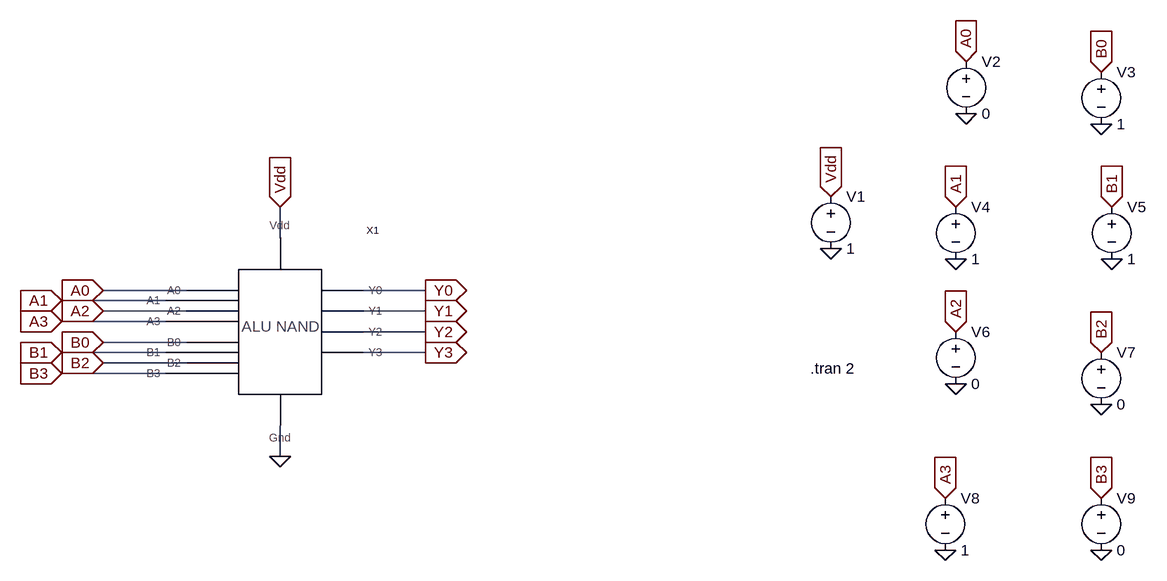
[diagram p0: schematic ALU_NAND_TEST.asc]
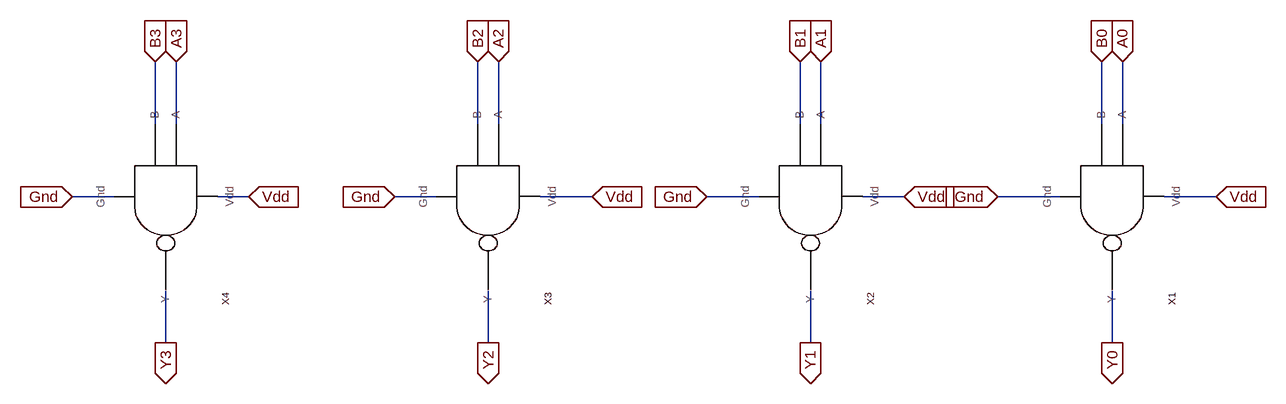
[diagram p1: sub-circuit alu_nand.asc]
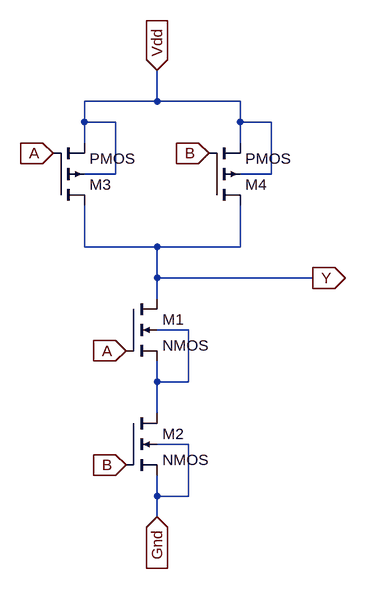
[diagram p2: sub-circuit nand.asc]
ALU_NAND_TEST.asc, the LTspice schematic file:
Version 4
SHEET 1 1656 680
WIRE 272 -144 272 -192
WIRE 128 -64 0 -64
WIRE 496 -64 400 -64
WIRE 96 -48 -64 -48
WIRE 128 -32 0 -32
WIRE 496 -32 400 -32
WIRE 96 -16 -64 -16
WIRE 496 0 400 0
WIRE 128 16 0 16
WIRE 96 32 -64 32
WIRE 496 32 400 32
WIRE 128 48 0 48
WIRE 96 64 -64 64
WIRE 272 192 272 144
FLAG 1120 -208 Vdd
IOPIN 1120 -208 In
FLAG 1328 -416 A0
IOPIN 1328 -416 In
FLAG 1536 -400 B0
IOPIN 1536 -400 In
FLAG 1312 -192 A1
IOPIN 1312 -192 In
FLAG 1552 -192 B1
IOPIN 1552 -192 In
FLAG 1312 0 A2
IOPIN 1312 0 In
FLAG 1536 32 B2
IOPIN 1536 32 In
FLAG 1296 256 A3
IOPIN 1296 256 In
FLAG 1536 256 B3
IOPIN 1536 256 In
FLAG 1120 -128 0
FLAG 1328 -336 0
FLAG 1536 -320 0
FLAG 1312 -112 0
FLAG 1552 -112 0
FLAG 1312 80 0
FLAG 1536 112 0
FLAG 1296 336 0
FLAG 1536 336 0
FLAG 272 192 0
FLAG 272 -192 Vdd
IOPIN 272 -192 In
FLAG 0 -64 A0
IOPIN 0 -64 In
FLAG -64 -48 A1
IOPIN -64 -48 In
FLAG 0 -32 A2
IOPIN 0 -32 In
FLAG -64 -16 A3
IOPIN -64 -16 In
FLAG 0 16 B0
IOPIN 0 16 In
FLAG -64 32 B1
IOPIN -64 32 In
FLAG 0 48 B2
IOPIN 0 48 In
FLAG -64 64 B3
IOPIN -64 64 In
FLAG 496 -64 Y0
IOPIN 496 -64 Out
FLAG 496 -32 Y1
IOPIN 496 -32 Out
FLAG 496 0 Y2
IOPIN 496 0 Out
FLAG 496 32 Y3
IOPIN 496 32 Out
SYMBOL ALU_NAND 288 -32 R0
SYMATTR InstName X1
SYMBOL voltage 1120 -224 R0
WINDOW 123 0 0 Left 0
WINDOW 39 0 0 Left 0
SYMATTR InstName V1
SYMATTR Value 1
SYMBOL voltage 1328 -432 R0
WINDOW 123 0 0 Left 0
WINDOW 39 0 0 Left 0
SYMATTR InstName V2
SYMATTR Value 0
SYMBOL voltage 1536 -416 R0
WINDOW 123 0 0 Left 0
WINDOW 39 0 0 Left 0
SYMATTR InstName V3
SYMATTR Value 1
SYMBOL voltage 1312 -208 R0
WINDOW 123 0 0 Left 0
WINDOW 39 0 0 Left 0
SYMATTR InstName V4
SYMATTR Value 1
SYMBOL voltage 1552 -208 R0
WINDOW 123 0 0 Left 0
WINDOW 39 0 0 Left 0
SYMATTR InstName V5
SYMATTR Value 1
SYMBOL voltage 1312 -16 R0
WINDOW 123 0 0 Left 0
WINDOW 39 0 0 Left 0
SYMATTR InstName V6
SYMATTR Value 0
SYMBOL voltage 1536 16 R0
WINDOW 123 0 0 Left 0
WINDOW 39 0 0 Left 0
SYMATTR InstName V7
SYMATTR Value 0
SYMBOL voltage 1296 240 R0
WINDOW 123 0 0 Left 0
WINDOW 39 0 0 Left 0
SYMATTR InstName V8
SYMATTR Value 1
SYMBOL voltage 1536 240 R0
WINDOW 123 0 0 Left 0
WINDOW 39 0 0 Left 0
SYMATTR InstName V9
SYMATTR Value 0
TEXT 1088 56 Left 2 !.tran 2

alu_nand.asc, the sub-circuit schematic file:
Version 4
SHEET 1 1000 680
WIRE -736 0 -736 -96
WIRE -704 0 -704 -96
WIRE -240 0 -240 -96
WIRE -208 0 -208 -96
WIRE 256 0 256 -96
WIRE 288 0 288 -96
WIRE 720 0 720 -96
WIRE 752 0 752 -96
WIRE -800 112 -864 112
WIRE -592 112 -640 112
WIRE -304 112 -368 112
WIRE -64 112 -144 112
WIRE 192 112 112 112
WIRE 416 112 352 112
WIRE 656 112 560 112
WIRE 896 112 816 112
WIRE -720 336 -720 256
WIRE -224 336 -224 256
WIRE 272 336 272 256
WIRE 736 336 736 256
FLAG 736 336 Y0
IOPIN 736 336 Out
FLAG 272 336 Y1
IOPIN 272 336 Out
FLAG -224 336 Y2
IOPIN -224 336 Out
FLAG -720 336 Y3
IOPIN -720 336 Out
FLAG 752 -96 A0
IOPIN 752 -96 In
FLAG 288 -96 A1
IOPIN 288 -96 In
FLAG -208 -96 A2
IOPIN -208 -96 In
FLAG -704 -96 A3
IOPIN -704 -96 In
FLAG 720 -96 B0
IOPIN 720 -96 In
FLAG 256 -96 B1
IOPIN 256 -96 In
FLAG -240 -96 B2
IOPIN -240 -96 In
FLAG -736 -96 B3
IOPIN -736 -96 In
FLAG -592 112 Vdd
IOPIN -592 112 In
FLAG -64 112 Vdd
IOPIN -64 112 In
FLAG 416 112 Vdd
IOPIN 416 112 In
FLAG 896 112 Vdd
IOPIN 896 112 In
FLAG 560 112 Gnd
IOPIN 560 112 In
FLAG 112 112 Gnd
IOPIN 112 112 In
FLAG -368 112 Gnd
IOPIN -368 112 In
FLAG -864 112 Gnd
IOPIN -864 112 In
SYMBOL nand 752 112 R90
SYMATTR InstName X1
SYMBOL nand 288 112 R90
SYMATTR InstName X2
SYMBOL nand -208 112 R90
SYMATTR InstName X3
SYMBOL nand -704 112 R90
SYMATTR InstName X4

nand.asc, the sub-circuit schematic file:
Version 4
SHEET 1 880 680
WIRE 192 -176 192 -224
WIRE 192 -176 80 -176
WIRE 320 -176 192 -176
WIRE 80 -144 80 -176
WIRE 128 -144 80 -144
WIRE 320 -144 320 -176
WIRE 368 -144 320 -144
WIRE 80 -112 80 -144
WIRE 320 -112 320 -144
WIRE 128 -64 128 -144
WIRE 128 -64 80 -64
WIRE 368 -64 368 -144
WIRE 368 -64 320 -64
WIRE 80 48 80 -16
WIRE 192 48 80 48
WIRE 320 48 320 -16
WIRE 320 48 192 48
WIRE 192 96 192 48
WIRE 432 96 192 96
WIRE 192 128 192 96
WIRE 240 176 192 176
WIRE 192 256 192 224
WIRE 240 256 240 176
WIRE 240 256 192 256
WIRE 192 304 192 256
WIRE 240 352 192 352
WIRE 192 432 192 400
WIRE 240 432 240 352
WIRE 240 432 192 432
WIRE 192 464 192 432
FLAG 192 464 Gnd
IOPIN 192 464 In
FLAG 144 384 B
IOPIN 144 384 In
FLAG 144 208 A
IOPIN 144 208 In
FLAG 32 -96 A
IOPIN 32 -96 In
FLAG 272 -96 B
IOPIN 272 -96 In
FLAG 432 96 Y
IOPIN 432 96 Out
FLAG 192 -224 Vdd
IOPIN 192 -224 In
SYMBOL nmos4 144 128 R0
SYMATTR InstName M1
SYMBOL nmos4 144 304 R0
SYMATTR InstName M2
SYMBOL pmos4 32 -16 M180
SYMATTR InstName M3
SYMBOL pmos4 272 -16 M180
SYMATTR InstName M4

The netlist it stands for:
* ALU_NAND_TEST.asc
XX1 A0 A1 A2 A3 B0 B1 B2 B3 Y0 Y1 Y2 Y3 Vdd 0 alu_nand
V1 Vdd 0 1
V2 A0 0 0
V3 B0 0 1
V4 A1 0 1
V5 B1 0 1
V6 A2 0 0
V7 B2 0 0
V8 A3 0 1
V9 B3 0 0

* block symbol definitions
.subckt alu_nand A0 A1 A2 A3 B0 B1 B2 B3 Y0 Y1 Y2 Y3 Vdd Gnd
XX1 A0 B0 Vdd Gnd Y0 nand
XX2 A1 B1 Vdd Gnd Y1 nand
XX3 A2 B2 Vdd Gnd Y2 nand
XX4 A3 B3 Vdd Gnd Y3 nand
.ends alu_nand

.subckt nand A B Vdd Gnd Y
M1 Y A N001 N001 NMOS
M2 N001 B Gnd Gnd NMOS
M3 Y A Vdd Vdd PMOS
M4 Y B Vdd Vdd PMOS
.ends nand

.model NMOS NMOS
.model PMOS PMOS
.lib standard.mos
.tran 2
.backanno
.end